# EAGLE design board2 (EAGLE 7.0.0)
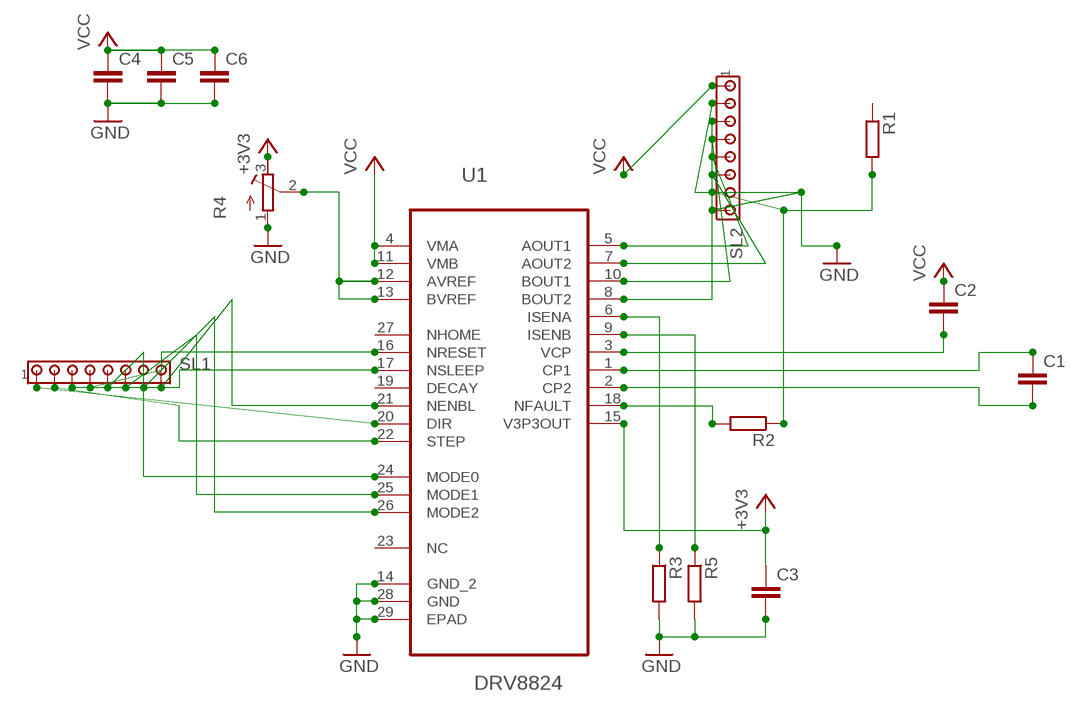
[diagram p0: schematic, sheet 1]

## Parts
C1  C-EUC0805  [C0805]
C2  C-EUC0805  [C0805]
C3  C-EUC0805  [C0805]
C4  C-EUC0805  [C0805]
C5  C-EUC0805  [C0805]
C6  C-EUC0805  [C0805]
R1  R-EU_M0805  [M0805]
R2  R-EU_M0805  [M0805]
R3  R-EU_M0805  [M0805]
R4  R-TRIMM4G/J  [RTRIM4G/J]
R5  R-EU_M0805  [M0805]
SL1  MTA08-100  [10X08MTA]
SL2  MTA08-100  [10X08MTA]
U1  DRV8824  DRV8824PWPR  [SOP65P640X120-29N]

## Nets
+3V3: C3.1 R4.3(A) U1.15(V3P3OUT)
AOUT1 [POWER]: SL2.5 U1.5(AOUT1)
AOUT2 [POWER]: SL2.6 U1.7(AOUT2)
BOUT1 [POWER]: SL2.4 U1.10(BOUT1)
BOUT2 [POWER]: SL2.3 U1.8(BOUT2)
GND [POWER]: C3.2 C4.2 C5.2 C6.2 R3.2 R4.1(E) R5.2 SL2.2 SL2.8 U1.14(GND_2) U1.28(GND) U1.29(EPAD)
N$1: SL1.1 U1.20(DIR)
N$2: SL1.2 U1.22(STEP)
N$3: SL1.3 U1.17(NSLEEP)
N$4: SL1.4 U1.16(NRESET)
N$5: SL1.5 U1.24(MODE0)
N$6: SL1.6 U1.25(MODE1)
N$7: SL1.7 U1.26(MODE2)
N$8: SL1.8 U1.21(NENBL)
N$9: R4.2(S) U1.12(AVREF) U1.13(BVREF)
N$10: C1.1 U1.1(CP1)
N$11: C1.2 U1.2(CP2)
N$12: C2.2 U1.3(VCP)
N$17: R2.2 U1.18(NFAULT)
N$18: R1.2 R2.1 SL2.7
N$19: R3.1 U1.6(ISENA)
N$20: R5.1 U1.9(ISENB)
VCC [POWER]: C2.1 C4.1 C5.1 C6.1 SL2.1 U1.4(VMA) U1.11(VMB)
Unconnected: R1.1 U1.19(DECAY) U1.23(NC) U1.27(NHOME)

## Library data of the parts
C1-C6 = resistor:C-EU: CAPACITOR, European symbol
R1-R3 R5 = resistor:R-EU_: RESISTOR, European symbol
R4 = resistor:R-TRIMM: Trimm resistor
SL1 SL2 = con-amp:MTA08-100: AMP connector; OC_FARNELL: unknown; OC_NEWARK: unknown
U1 = ti_e14:DRV8824PWPR: STEPPER MOTOR CONTROLLER IC; MPN: DRV8824PWPR; OC_FARNELL: -; OC_NEWARK: 74R6336; PACKAGE: TSSOP-28; SUPPLIER: Texas Instruments

## Board
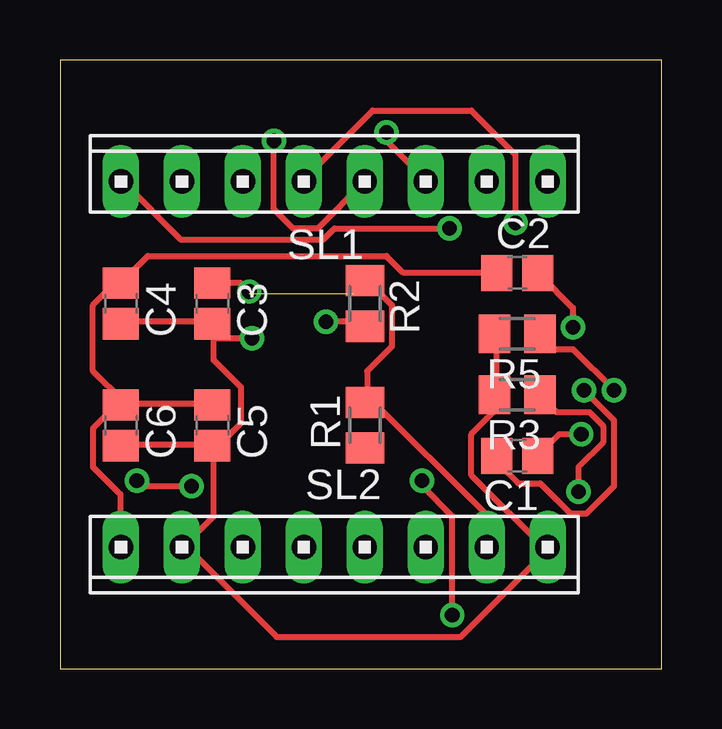
[diagram p1: board, top side]
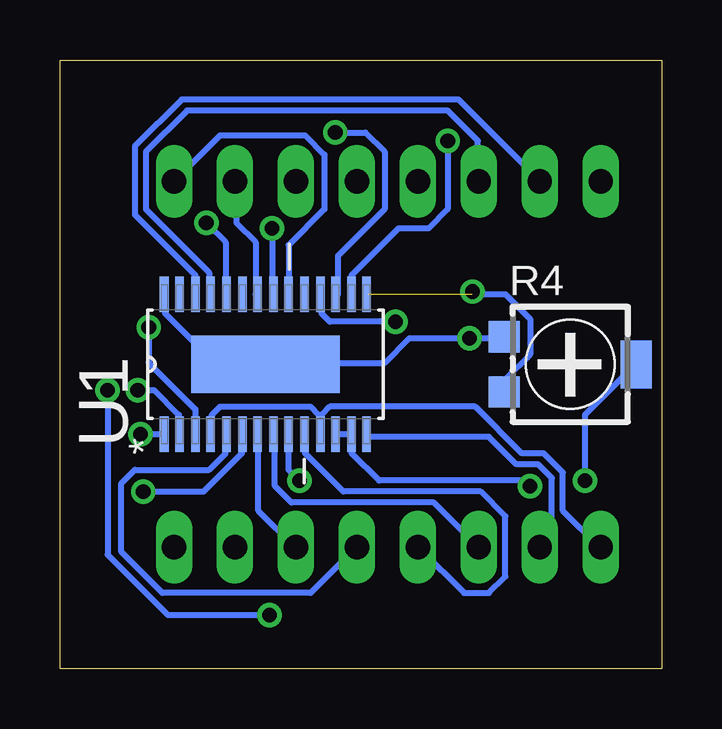
[diagram p2: board, bottom side, seen from below]

Size 25.07 x 25.39 mm. Coordinates in mm from the lower left corner, seen from the top.
Outline: 0,0 25.07,0 25.07,25.39 0,25.39 0,0
Copper layers (1*16): Top 0.035mm / dielectric 1.5mm / Bottom 0.035mm
Design rules "default": minimum track width 10mil, minimum drill 24mil, track to track 8mil, track to pad 8mil, pad to pad 8mil, via to via 8mil, smd to smd 8mil, copper to edge 40mil, drill to drill 8mil, minimum pad ring 10mil, minimum via ring 8mil, stop-mask expansion 4mil, vias tented up to drill 0mil, thermal gap 10mil

### Footprints (pad centres in the part's own frame; a part is rotated, then mirrored left to right if it is on the bottom)
C0805 = smd 1.3 x 1.5: 1 -0.85,0; 2 0.85,0
M0805 = smd 1.3 x 1.6: 1 -0.95,0; 2 0.95,0
RTRIM4G/J = smd 1.3 x 1.3: 1 -1.15,-2.75; 3 1.15,-2.75 | smd 2 x 1.3: 2 0,2.75
10X08MTA = drill 1.016 long: 1 8.89,0; 2 6.35,0; 3 3.81,0; 4 1.27,0; 5 -1.27,0; 6 -3.81,0; 7 -6.35,0; 8 -8.89,0
SOP65P640X120-29N = smd 1.473 x 0.356: 1 -2.921,4.216; 2 -2.921,3.581; 3 -2.921,2.921; 4 -2.921,2.286; 5 -2.921,1.626; 6 -2.921,0.965; 7 -2.921,0.33; 8 -2.921,-0.33; 9 -2.921,-0.965; 10 -2.921,-1.626; 11 -2.921,-2.286; 12 -2.921,-2.921; 13 -2.921,-3.581; 14 -2.921,-4.216; 15 2.921,-4.216; 16 2.921,-3.581; 17 2.921,-2.921; 18 2.921,-2.286; 19 2.921,-1.626; 20 2.921,-0.965; 21 2.921,-0.33; 22 2.921,0.33; 23 2.921,0.965; 24 2.921,1.626; 25 2.921,2.286; 26 2.921,2.921; 27 2.921,3.581; 28 2.921,4.216 | smd 2.388 x 6.172: 29 0,0

### Placement (x,y rotation side)
C1  19.05,8.89 180 top
C2  19.05,16.51 0 top
C3  6.35,15.24 270 top
C4  2.54,15.24 270 top
C5  6.35,10.16 270 top
C6  2.54,10.16 270 top
R1  12.7,10.16 90 top
R2  12.7,15.24 270 top
R3  19.05,11.43 180 top
R4  3.81,12.7 270 bottom
R5  19.05,13.97 180 top
SL1  11.43,20.32 0 top
SL2  11.43,5.08 180 top
U1  16.51,12.7 90 bottom

### Tracks (layer width: path | path; a pad name or v marks a point on that pad's centre or on a via)
+3V3  (via drill 0.61)  (1 unrouted)
  Top 0.254: v7.89,15.74 7.54,16.08 6.4,16.08 C3.1
  Bottom 0.254: R4.3 6.51,11.62 6.51,12.08 5.49,13.11 5.49,14.59 6.51,15.62 7.89,15.62 v7.89,15.74 | 12.23,15.62 U1.15
AOUT1
  Bottom 0.254: U1.5 18.17,9.68 18.17,8.99 18.86,8.31 21.95,8.31 22.52,7.73 22.52,4.88 20.8,3.16 14.63,3.16 12.8,4.99 SL2.5
AOUT2
  Bottom 0.254: U1.7 16.8,9.68 16.8,6.59 15.32,5.1 SL2.6
BOUT1
  Bottom 0.254: U1.10 14.86,9.68 14.86,8.99 13.26,7.39 7.54,7.39 6.51,6.36 6.51,3.85 7.2,3.16 8.23,3.16 10.06,4.99 SL2.4
BOUT2
  Bottom 0.254: U1.8 16.12,9.68 16.12,7.62 15.43,6.93 9.49,6.93 7.66,5.1 SL2.3
GND  (via drill 0.61)
  Top 0.254: R5.2 18.17,13.91 18.17,11.51 R3.2 18.06,11.39 18.06,10.71 17.14,9.79 17.14,8.08 20.23,4.99 SL2.8 20.23,4.88 16.69,1.33 9.03,1.33 5.26,5.1 SL2.2 5.14,5.1 6.4,6.36 6.4,9.22 C5.2 | C4.2 2.63,14.48 6.29,14.48 C3.2 | C6.2 2.63,9.33 6.29,9.33 C5.2 | C3.2 6.4,14.36 6.4,12.88 7.54,11.73 7.54,10.25 6.51,9.22 C5.2 | v8,13.79 6.51,13.79 C3.2
  Bottom 0.254: R4.1 6.63,13.79 v8,13.79 10.52,13.79 11.54,12.76 16.46,12.76 U1.29 16.57,12.76 18.63,12.76 20.69,14.82 20.69,15.62 U1.28 | U1.14 12.23,9.68 7.2,9.68 6.06,8.53 5.14,8.53 4.57,7.96 4.57,5.56 5.03,5.1 SL2.2
N$1
  Bottom 0.254: U1.20 15.54,17.68 14.06,19.16 14.06,21.45 14.86,22.25 18.4,22.25 20.23,20.42 SL1.1
N$2
  Bottom 0.254: U1.22 16.92,15.62 16.92,17.79 17.72,18.59 17.72,20.31 SL1.2
N$3  (via drill 0.61)
  Top 0.254: v13.6,22.37 13.6,22.02 15.2,20.42 SL1.3
  Bottom 0.254: v13.6,22.37 12.34,22.37 11.54,21.57 11.54,19.16 13.49,17.22 13.49,15.62 U1.17
N$4  (via drill 0.61)
  Top 0.254: v8.91,22.02 8.91,19.16 9.72,18.36 10.74,18.36 12.69,20.31 SL1.4
  Bottom 0.254: v8.91,22.02 8.91,19.16 9.72,18.36 10.97,18.36 12.92,16.42 12.92,15.62 U1.16
N$5  (via drill 0.61)
  Top 0.254: v18.97,18.59 18.97,21.45 17.14,23.28 13.03,23.28 10.17,20.42 SL1.5
  Bottom 0.254: v18.97,18.59 18.17,17.79 18.17,15.62 U1.24
N$6
  Bottom 0.254: U1.25 18.86,15.62 18.86,16.54 21.49,19.16 21.49,21.57 19.77,23.28 8.91,23.28 7.66,22.02 7.66,20.42 SL1.6
N$7
  Bottom 0.254: U1.26 19.43,16.42 21.95,18.94 21.95,21.79 20,23.74 8.46,23.74 5.14,20.42 SL1.7
N$8  (via drill 0.61)
  Top 0.254: v16.23,18.36 11.43,18.36 10.97,17.91 5.03,17.91 2.63,20.31 SL1.8
  Bottom 0.254: v16.23,18.36 16.23,15.62 U1.21
N$9  (via drill 0.61)
  Top 0.254: v5.49,7.62 3.43,7.62 v3.2,7.85
  Bottom 0.254: U1.12 13.49,9.79 13.03,9.79 U1.13 12.92,9.68 12.92,8.99 11.77,7.85 5.71,7.85 v5.49,7.62 | v3.2,7.85 3.2,10.59 1.14,12.65 R4.2
N$10  (via drill 0.61)
  Top 0.254: v21.72,9.79 20.8,9.79 20,8.99 C1.1
  Bottom 0.254: v21.72,9.79 20.8,9.79 U1.1
N$11  (via drill 0.61)
  Top 0.254: v21.83,11.62 23.09,10.36 23.09,7.62 21.95,6.48 21.26,6.48 20,7.73 19.09,7.73 18.29,8.53 18.29,8.88 C1.2
  Bottom 0.254: v21.83,11.62 21.14,11.62 20.12,10.59 20.12,9.79 U1.2
N$12  (via drill 0.61)
  Top 0.254: v21.37,14.25 21.37,15.05 20,16.42 C2.2
  Bottom 0.254: v21.37,14.25 21.37,12.76 19.43,10.82 19.43,9.79 U1.3
N$17  (via drill 0.61)
  Top 0.254: v11.09,14.48 12.57,14.48 12.69,14.36 R2.2
  Bottom 0.254: v11.09,14.48 13.83,14.48 14.17,14.82 14.17,15.62 U1.18
N$18
  Top 0.254: R2.1 12.8,16.19 13.83,15.16 13.83,13.45 12.8,12.42 12.8,11.16 R1.2 12.92,11.28 17.72,6.48 17.72,5.1 SL2.7
N$19  (via drill 0.61)
  Top 0.254: v21.6,7.39 21.6,8.42 22.63,9.45 22.63,10.13 22.06,10.71 20.69,10.71 20,11.39 R3.1
  Bottom 0.254: v21.6,7.39 19.09,7.39 17.49,8.99 17.49,9.68 U1.6
N$20  (via drill 0.61)
  Top 0.254: v15.09,7.85 15.09,7.62 16.34,6.36 v16.34,2.25 | v23.09,11.62 21.37,13.33 20.57,13.33 20,13.91 R5.1
  Bottom 0.254: v15.09,7.85 15.54,8.31 15.54,9.68 U1.9 | v16.34,2.25 20.57,2.25 23.09,4.76 v23.09,11.62
VCC
  Top 0.254: C6.1 2.63,11.05 6.29,11.05 C5.1 | C6.1 2.63,11.16 1.37,12.42 1.37,15.16 2.29,16.08 2.52,16.08 C4.1 2.63,16.19 3.66,17.22 13.6,17.22 14.29,16.54 18.17,16.54 C2.1 | SL2.1 2.52,5.1 2.52,7.28 1.37,8.42 1.37,10.02 2.52,11.16 C6.1
  Bottom 0.254: 14.29,10.59 14.29,9.79 U1.11 | 14.29,10.59 14.63,10.93 18.4,10.93 18.75,10.59 18.75,9.79 U1.4 | 14.29,10.59 14.17,10.59 13.83,10.93 7.77,10.93 5.83,8.99 4.92,8.99 4.12,8.19 4.12,6.59 2.63,5.1 SL2.1